# Altium project PCB_Project_2.PrjPcb
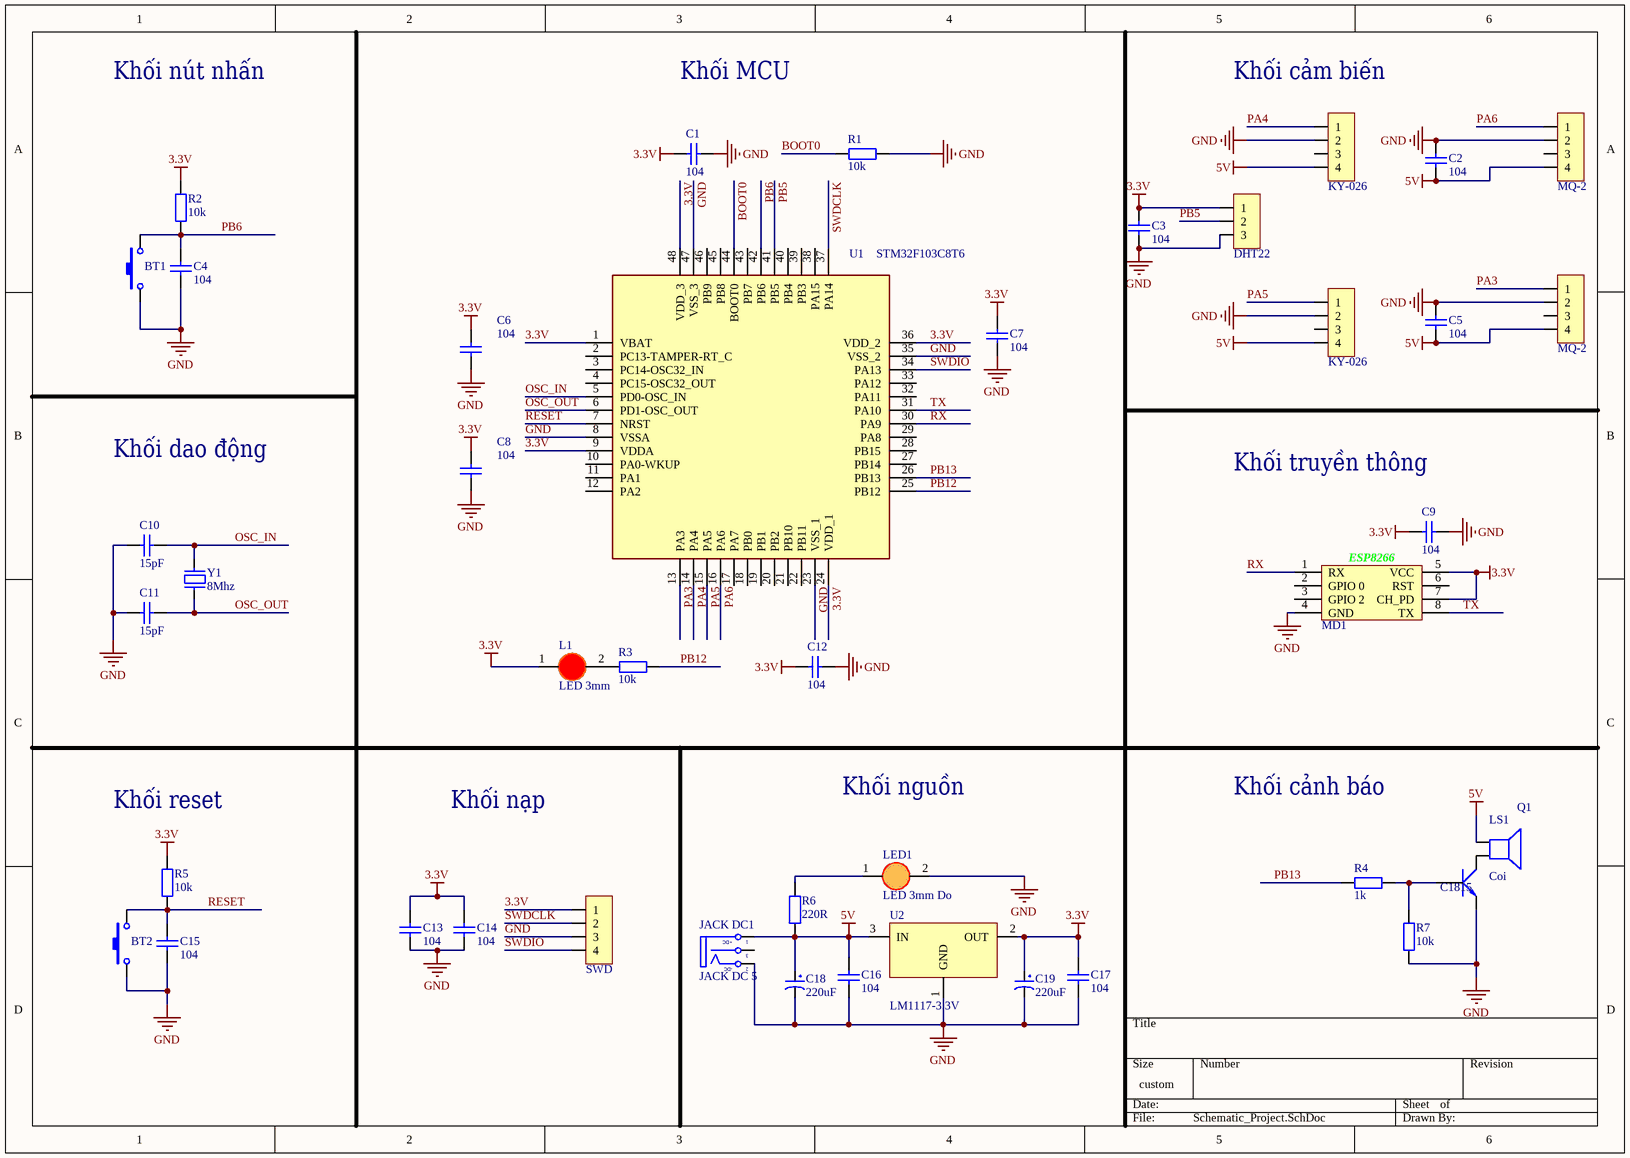
[diagram p0: Schematic_Project.SchDoc]
1 sheet, 43 parts. Net scope: global (net labels, ports and power ports of the same name join across sheets).
Board file: PCB_Final.PcbDoc

## Sheet Schematic_Project.SchDoc
size 304 x 215 mm; SheetNumber: 1; SheetTotal: 1

### Parts
BT1  Nut Nhan 2 Chan SMD 3x6x2.5  [Nut Nhan 2 Chan SMD 3x6x2.5]  (value not drawn)
BT2  Nut Nhan 2 Chan SMD 3x6x2.5  [Nut Nhan 2 Chan SMD 3x6x2.5]  (value not drawn)
C1  104  [tu gom]
C2  104  [tu gom]
C3  104  [tu gom]
C4  104  [tu gom]
C5  104  [tu gom]
C6  104  [tu gom]
C7  104  [tu gom]
C8  104  [tu gom]
C9  104  [tu gom]
C10  15pF  [tu gom]
C11  15pF  [tu gom]
C12  104  [tu gom]
C13  104  [tu gom]
C14  104  [tu gom]
C15  104  [tu gom]
C16  104  [tu gom]
C17  104  [tu gom]
C18  220uF  [tu hoa 5mm]
C19  220uF  [tu hoa 5mm]
JACK_DC1  JACK DC 5  [JACK DC 5.5]
JP1  KY-026  [JP 1x4 DT]
JP2  MQ-2  [JP 1x4 DT]
JP3  DHT22  [JP 1x3 DT]
JP4  KY-026  [JP 1x4 DT]
JP5  MQ-2  [JP 1x4 DT]
JP6  SWD  [JP 1x4 DT]
L1  LED 3mm  [LED-3MM-RED]
LED1  LED 3mm Do  [LED 3mm Do]
LS1  Coi  [Coi Chip Speacker]
MD1  ESP8266 Module  [ESP2866 Module]  (value not drawn)
Q1  C1815  [TO92]
R1  10k  [tro vach 1/4w]
R2  10k  [tro vach 1/4w]
R3  10k  [tro vach 1/4w]
R4  1k  [tro vach 1/4w]
R5  10k  [tro vach 1/4w]
R6  220R  [tro vach 1/4w]
R7  10k  [tro vach 1/4w]
U1  STM32F103C8T6  [LQFP-48_19.6_393_58X11_SMD]
U2  LM1117-3.3V  [SOT223]
Y1  8Mhz  [Thach Anh 2 chan SMD]

### Nets
3.3V: C1.1 C3.1 C6.1 C7.1 C8.1 C9.1 C12.2 C13.1 C14.1 C17.2 C19.1 JP3.1 JP6.1 L1.1(A) MD1.5(VCC) MD1.7(CH_PD) R2.2 R5.2 U1.1(VBAT) U1.9(VDDA) U1.24(VDD_1) U1.36(VDD_2) U1.48(VDD_3) U2.2(OUT)
5V: C2.1 C5.2 C16.1 C18.1 JACK_DC1.1(T) JP1.4 JP2.4 JP4.4 JP5.4 LS1.1 R6.1 U2.3(IN)
GND: BT1.1 BT2.1 C1.2 C2.2 C3.2 C4.2 C5.1 C6.2 C7.2 C8.2 C9.2 C10.2 C11.2 C12.1 C13.2 C14.2 C15.2 C16.2 C17.1 C18.2 C19.2 JACK_DC1.2(TN) JP1.2 JP2.2 JP3.3 JP4.2 JP5.2 JP6.3 LED1.2(K) MD1.4(GND) Q1.1(E) R1.1 R7.1 U1.8(VSSA) U1.23(VSS_1) U1.35(VSS_2) U1.47(VSS_3) U2.1(GND)
BOOT0: R1.2 U1.44(BOOT0)
OSC_IN: C10.1 U1.5(PD0-OSC_IN) Y1.2
OSC_OUT: C11.1 U1.6(PD1-OSC_OUT) Y1.1
PA3: JP5.1 U1.13(PA3)
PA4: JP1.1 U1.14(PA4)
PA5: JP4.1 U1.15(PA5)
PA6: JP2.1 U1.16(PA6)
PB5: JP3.2 U1.41(PB5)
PB6: BT1.2 C4.1 R2.1 U1.42(PB6)
PB12: R3.2 U1.25(PB12)
PB13: R4.1 U1.26(PB13)
RESET: BT2.2 C15.1 R5.1 U1.7(NRST)
RX: MD1.1(RX) U1.30(PA9)
SWDCLK: JP6.2 U1.37(PA14)
SWDIO: JP6.4 U1.34(PA13)
TX: MD1.8(TX) U1.31(PA10)
NetL1_2: L1.2(K) R3.1
NetLED1_1: LED1.1(A) R6.2
NetLS1_2: LS1.2 Q1.2(C)
NetQ1_3: Q1.3(B) R4.2 R7.2

Not connected (* = marked no-connect by the designer): JACK_DC1 3(S); JP1 3; JP2 3; JP4 3; JP5 3; MD1 2(GPIO_0) 3(GPIO_2) 6(RST); U1 2(PC13-TAMPER-RT_C) 3(PC14-OSC32_IN) 4(PC15-OSC32_OUT) 10(PA0-WKUP) 11(PA1) 12(PA2) 17(PA7) 18(PB0) 19(PB1) 20(PB2) 21(PB10) 22(PB11) 27(PB14) 28(PB15) 29(PA8) 32(PA11) 33(PA12) 38(PA15) 39(PB3) 40(PB4) 43(PB7) 45(PB8) 46(PB9)

### Notes on the sheet
- Khối nút nhấn
- Khối MCU
- (near JP1) Khối cảm biến
- Khối dao động
- Khối truyền thông
- Khối reset
- Khối nạp
- Khối nguồn
- Khối cảnh báo
- (in symbol ESP8266 Module) ESP8266
- (in symbol JACK DC 5.5) +DC; -DC

### Library data of the parts
BT1 BT2 = Nut Nhan 2 Chan SMD 3x6x2.5: Ma_Hang: MH001036; Ten: Nút Nhấn 2 Chân 3x6x2.5MM SMD
C1-C9 C12-C17 = Tu gom 104 50V: Cắm; So_Chan: 2; Ten_Linh_Kien: Tụ gốm 104 100nF 50V; Don_Vi: Con; Ma_Hang: MH004761; Chung_Loai: Cắm; Kieu_Chan: *
C10 C11 = Tu gom 15pF 50V: Cắm; Don_Vi: Con; So_Chan: 2; Ten_Linh_Kien: Tụ gốm 15P 50V; Ma_Hang: MH004767; Chung_Loai: Cắm; Kieu_Chan: *
C18 C19 = Tu Hoa 220uF 10V 6x11: Cắm; Don_Vi: Con; So_Chan: 2; Ten_Linh_Kien: Tụ Hóa 220uF 10V 6x11MM; Ma_Hang: MH004510; Chung_Loai: Cắm; Kieu_Chan: *
JACK_DC1 = JACK DC 5.5: Value: Jac DC
JP1 JP2 JP4-JP6 = JP 1x4 2.54 Duc Thang: Cắm; Ten_Linh_Kien: Jump Đơn Đực 2.54MM 1x40P Thẳng 11MM; Don_Vi: Con; Ma_Hang: MH000903; Ghi_Chu: *; Kieu_Chan: *; Chung_Loai: Cắm
JP3 = JP 1x3 2.54 Duc Thang: Cắm; Ten_Linh_Kien: Jump Đơn Đực 2.54MM 1x40P Thẳng 11MM; Don_Vi: Con; Ma_Hang: MH000903; Ghi_Chu: *; Kieu_Chan: *; Chung_Loai: Cắm
L1 = LED 3mm Do: Cắm; Don_Vi: Con; Ma_Hang: MH003892; Ten_Linh_Kien: Led 3MM Phủ Đỏ (10c); Ghi_Chu: *; Kieu_Chan: *; Chung_Loai: Cắm
LED1 = LED 3mm Do: Cắm; Ten_Linh_Kien: LED 3MM Sáng Đỏ ( SS); Ma_Hang: MH004931; Don_Vi: Con; Ghi_Chu: *; Kieu_Chan: *; Chung_Loai: Cắm
LS1 = Coi Chip Speaker: Còi chip
Q1 = C1815: NPN transistor; Value: C9014
R1-R3 R5 R7 = Tro Vach 1/4W 1% 10k: Cắm; Don_Vi: Con; So_Chan: 2; Ten_Linh_Kien: Trở Vạch 1/4w 1% 10k; Ma_Hang: MH006349; Chung_Loai: Cắm; Kieu_Chan: *
R4 = Tro Vach 1/4W 5% 1k: Cắm; Don_Vi: Con; So_Chan: 2; Ten_Linh_Kien: Trở Vạch 1/4w 5% 1k; Ma_Hang: MH007390; Chung_Loai: Cắm; Kieu_Chan: *
R6 = Tro Vach 1/4W 5% 220R: Cắm; Don_Vi: Con; So_Chan: 2; Ten_Linh_Kien: Trở Vạch 1/4w 5% 220R; Ma_Hang: MH007300; Chung_Loai: Cắm; Kieu_Chan: *
U1 = IC_STM32F103C8T6: ARM® Cortex®-M3 STM32F1 Microcontroller IC 32-Bit 72MHz 64KB (64K x 8) FLASH 48-LQFP (7x7) /; Manufacturer: STMicroelectronics; Alternate Part Number-1: NA; Manufacturer Part Number: STM32F103C8T6; Case/Package: LQFP48; Supplier-1: LCSC; Supplier Part Number-1: STM32F103C8T6
U2 = LM1117: 800mA Low-Dropout Linear Regulator; Creator: Nguyen Ba Bien; Website: http://group3i.net
Y1 = Thach Anh 2 chan SMD: Crystal For all Crystal 2pin.; Value: 4Mhz